# Altium schematic sheet PDM-S04-V00-Microcontroller.SchDoc: Microcontroller
size A3; DrawnBy: Zoe Goodward; Organization: QUT Motorsport; Address1: O-120, Gardens Point; Address2: 2 George Street; Address3: Brisbane, QLD 4000; Address4: Australia; DocumentNumber: 4; Revision: 00; SheetNumber: 4; SheetTotal: 9; Version: 00; Project: Power Distribution Module; PageSetup: Record=PageOptions|CenterHorizontal=True|CenterVertical=True|PrintScale=0.97|XCorrection=1.00|YCorrection=1.00|PrintKind=0|BorderSize=5000000|LeftOffset=0|BottomOffset=0|Orientation=2|PaperLength=1000|PaperWidth=1000|Scale=100|PaperSource=7|PrintQuality=-4|MediaType=1|DitherType=10|PaperKind=A4|PrintScaleMode=1
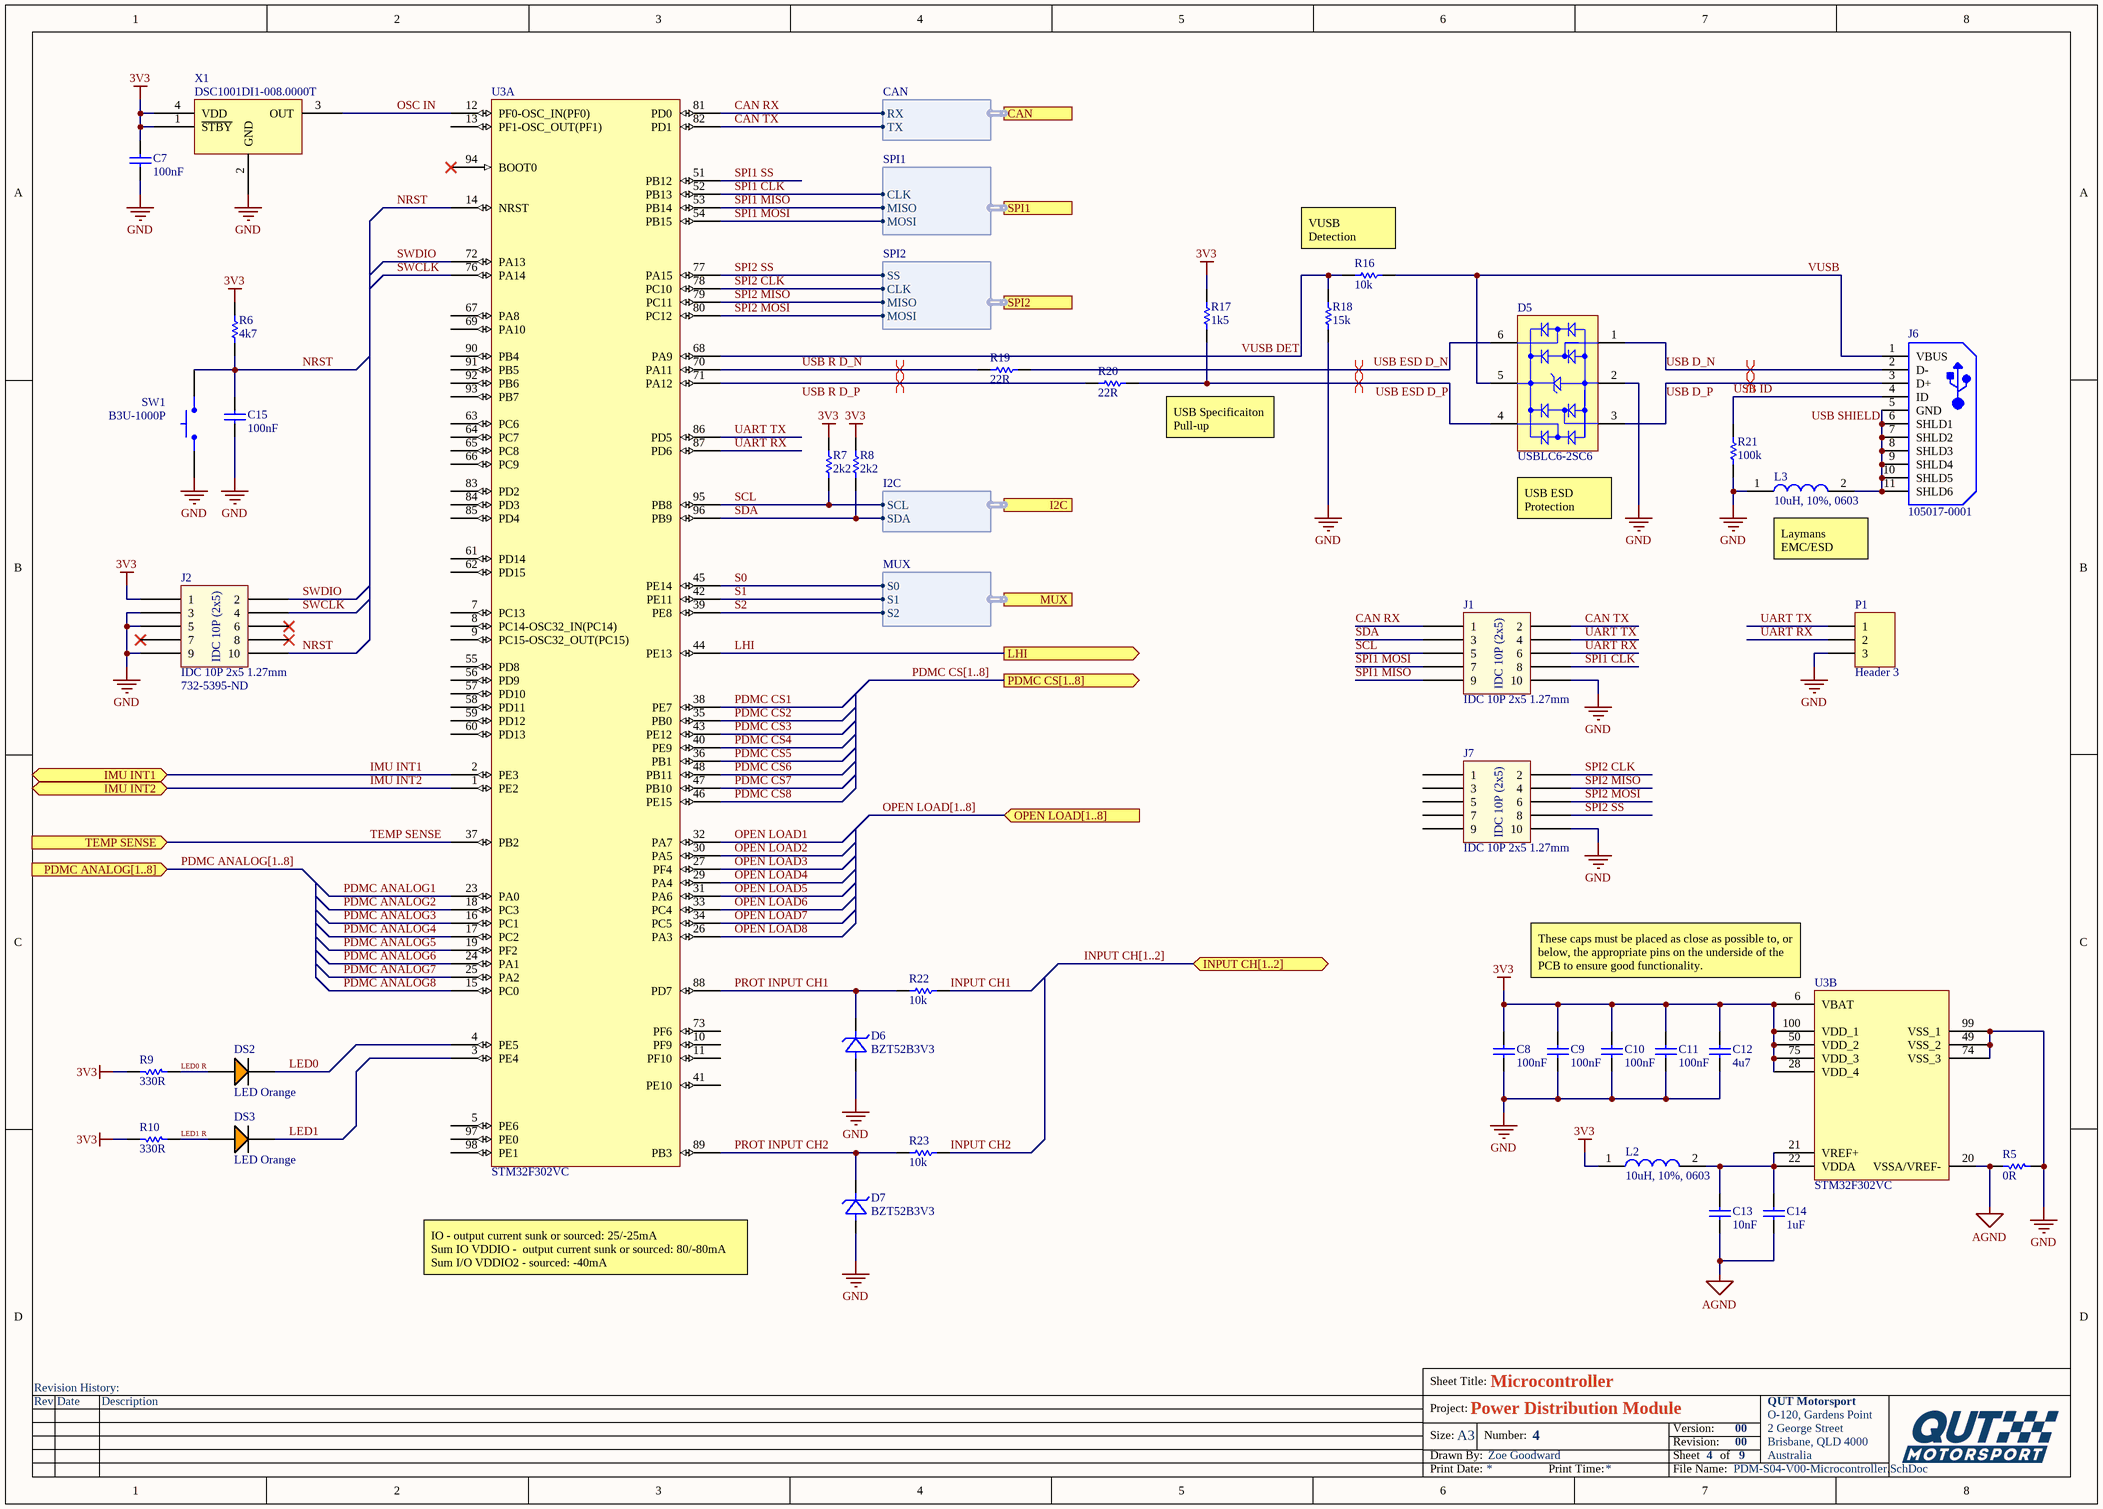
[diagram p0: PDM-S04-V00-Microcontroller.SchDoc]

## Parts
C7  100nF  [Cap_Ceramic_0603]
C8  100nF  [Cap_Ceramic_0603]
C9  100nF  [Cap_Ceramic_0603]
C10  100nF  [Cap_Ceramic_0603]
C11  100nF  [Cap_Ceramic_0603]
C12  4u7  [Cap_Ceramic_0603]
C13  10nF  [Cap_Ceramic_0603]
C14  1uF  [Cap_Ceramic_0603]
C15  100nF  [Cap_Ceramic_0603]
D5  USBLC6-2SC6  [STM-SOT23-6L_V]
D6  BZT52B3V3  [SOD123]
D7  BZT52B3V3  [SOD123]
DS2  LED Orange  [LED ORANGE 0603]
DS3  LED Orange  [LED ORANGE 0603]
J1  IDC 10P 2x5 1.27mm  [IDC 1.27MM 10P]
J2  IDC 10P 2x5 1.27mm  [IDC 1.27MM 10P]
J6  105017-0001  [USB-MICRO-B_V]
J7  IDC 10P 2x5 1.27mm  [IDC 1.27MM 10P]
L2  10uH, 10%, 0603  [Inductor_0603]
L3  10uH, 10%, 0603  [Inductor_0603]
P1  Header 3  [HDR1X3]
R5  0R  [Res_ThinFilm_0603]
R6  4k7  [Res_ThinFilm_0603]
R7  2k2  [Res_ThinFilm_0603]
R8  2k2  [Res_ThinFilm_0603]
R9  330R  [Res_ThinFilm_0603]
R10  330R  [Res_ThinFilm_0603]
R16  10k  [Res_ThinFilm_0603]
R17  1k5  [Res_ThinFilm_0603]
R18  15k  [Res_ThinFilm_0603]
R19  22R  [Res_ThinFilm_0603]
R20  22R  [Res_ThinFilm_0603]
R21  100k  [Res_ThinFilm_0603]
R22  10k  [Res_ThinFilm_0603]
R23  10k  [Res_ThinFilm_0603]
SW1  B3U-1000P  [BTN B3U-1000P]
U3  STM32F302VC  [STM-LQFP100]  (parts A,B of 2)
X1  DSC1001DI1-008.0000T  [DSC1001DI1-008.0000TCT-ND]

## Ports
CAN (harness CAN), I2C (harness I2C), IMU INT1 (bidir), IMU INT2 (bidir), INPUT CH[1..2] (bidir), LHI (out), MUX (harness MUX), OPEN LOAD[1..8] (in), PDMC ANALOG[1..8] (in), PDMC CS[1..8] (out), SPI1 (harness SPI1), SPI2 (harness SPI2), TEMP SENSE (in)

## Harnesses
CAN: RX, TX
SPI1: CLK, MISO, MOSI
MUX: S0, S1, S2
I2C: SDA, SCL
SPI2: CLK, MISO, MOSI, SS

## Nets
3V3: C7.2 C8.2 C9.2 C10.2 C11.2 C12.2 J2.1 L2.1 R6.2 R7.2 R8.2 R9.2 R10.2 R17.2 U3.6(VBAT) U3.28(VDD_4) U3.50(VDD_2) U3.75(VDD_3) U3.100(VDD_1) X1.1(~{STBY}) X1.4(VDD)
AGND: C13.1 C14.1 R5.2 U3.20(VSSA/VREF-)
GND: C7.1 C8.1 C9.1 C10.1 C11.1 C12.1 C15.1 D5.2(GND) D6.A(Anode) D7.A(Anode) J1.10 J2.3 J2.5 J2.9 J7.10 L3.1 P1.3 R5.1 R18.1 R21.1 SW1.1 U3.49(VSS_2) U3.74(VSS_3) U3.99(VSS_1) X1.2(GND)
CAN RX: J1.1 U3.81(PD0) ; port CAN.RX
CAN TX: J1.2 U3.82(PD1) ; port CAN.TX
IMU INT1: U3.2(PE3) ; port IMU INT1
IMU INT2: U3.1(PE2) ; port IMU INT2
INPUT CH1: R22.2
INPUT CH2: R23.2
LED0: DS2.2(C) U3.4(PE5)
LED0 R: DS2.1(A) R9.1
LED1: DS3.2(C) U3.3(PE4)
LED1 R: DS3.1(A) R10.1
LHI: U3.44(PE13) ; port LHI
NRST: C15.2 J2.10 R6.1 SW1.2 U3.14(NRST)
OPEN LOAD1: U3.32(PA7)
OPEN LOAD2: U3.30(PA5)
OPEN LOAD3: U3.27(PF4)
OPEN LOAD4: U3.29(PA4)
OPEN LOAD5: U3.31(PA6)
OPEN LOAD6: U3.33(PC4)
OPEN LOAD7: U3.34(PC5)
OPEN LOAD8: U3.26(PA3)
OSC IN: U3.12(PF0-OSC_IN(PF0)) X1.3(OUT)
PDMC ANALOG1: U3.23(PA0)
PDMC ANALOG2: U3.18(PC3)
PDMC ANALOG3: U3.16(PC1)
PDMC ANALOG4: U3.17(PC2)
PDMC ANALOG5: U3.19(PF2)
PDMC ANALOG6: U3.24(PA1)
PDMC ANALOG7: U3.25(PA2)
PDMC ANALOG8: U3.15(PC0)
PDMC CS1: U3.38(PE7)
PDMC CS2: U3.35(PB0)
PDMC CS3: U3.43(PE12)
PDMC CS4: U3.40(PE9)
PDMC CS5: U3.36(PB1)
PDMC CS6: U3.48(PB11)
PDMC CS7: U3.47(PB10)
PDMC CS8: U3.46(PE15)
PROT INPUT CH1: D6.K(Cathode) R22.1 U3.88(PD7)
PROT INPUT CH2: D7.K(Cathode) R23.1 U3.89(PB3)
S0: U3.45(PE14) ; port MUX.S0
S1: U3.42(PE11) ; port MUX.S1
S2: U3.39(PE8) ; port MUX.S2
SCL: J1.5 R7.1 U3.95(PB8) ; port I2C.SCL
SDA: J1.3 R8.1 U3.96(PB9) ; port I2C.SDA
SPI1 CLK: J1.8 U3.52(PB13) ; port SPI1.CLK
SPI1 MISO: J1.9 U3.53(PB14) ; port SPI1.MISO
SPI1 MOSI: J1.7 U3.54(PB15) ; port SPI1.MOSI
SPI1 SS: U3.51(PB12)
SPI2 CLK: J7.2 U3.78(PC10) ; port SPI2.CLK
SPI2 MISO: J7.4 U3.79(PC11) ; port SPI2.MISO
SPI2 MOSI: J7.6 U3.80(PC12) ; port SPI2.MOSI
SPI2 SS: J7.8 U3.77(PA15) ; port SPI2.SS
SWCLK: J2.4 U3.76(PA14)
SWDIO: J2.2 U3.72(PA13)
TEMP SENSE: U3.37(PB2) ; port TEMP SENSE
UART RX: J1.6 P1.2 U3.87(PD6)
UART TX: J1.4 P1.1 U3.86(PD5)
USB D_N: D5.1(I/O_1) J6.2(D-)
USB D_P: D5.3(I/O_2) J6.3(D+)
USB ESD D_N: D5.6(I/O_4) R19.2
USB ESD D_P: D5.4(I/O_3) R17.1 R20.2
USB ID: J6.4(ID) R21.2
USB R D_N: R19.1 U3.70(PA11)
USB R D_P: R20.1 U3.71(PA12)
USB SHIELD: J6.5(GND) J6.6(SHLD1) J6.7(SHLD2) J6.8(SHLD3) J6.9(SHLD4) J6.10(SHLD5) J6.11(SHLD6) L3.2
VUSB: D5.5(VBUS) J6.1(VBUS) R16.2
VUSB DET: R16.1 R18.2 U3.68(PA9)
NetC13_2: C13.2 C14.2 L2.2 U3.21(VREF+) U3.22(VDDA)

Not connected (* = marked no-connect by the designer): J2 6* 7* 8*; J7 1 3 5 7 9; U3 5(PE6) 7(PC13) 8(PC14-OSC32_IN(PC14)) 9(PC15-OSC32_OUT(PC15)) 10(PF9) 11(PF10) 13(PF1-OSC_OUT(PF1)) 41(PE10) 55(PD8) 56(PD9) 57(PD10) 58(PD11) 59(PD12) 60(PD13) 61(PD14) 62(PD15) 63(PC6) 64(PC7) 65(PC8) 66(PC9) 67(PA8) 69(PA10) 73(PF6) 83(PD2) 84(PD3) 85(PD4) 90(PB4) 91(PB5) 92(PB6) 93(PB7) 94(BOOT0)* 97(PE0) 98(PE1)

## Buses and harness runs
bus INPUT CH[1..2] = port INPUT CH[1..2]
bus OPEN LOAD[1..8] = port OPEN LOAD[1..8]
bus PDMC ANALOG[1..8] = port PDMC ANALOG[1..8]
bus PDMC CS[1..8] = port PDMC CS[1..8]

## Layout directives
differential pair; USB D: true: USB D_N, USB D_P
differential pair: USB ESD D_N, USB ESD D_P, USB R D_N, USB R D_P

## Notes on the sheet
- (near R16) VUSB Detection
- USB Specificaiton Pull-up
- USB ESD Protection
- (near L3) Laymans EMC/ESD
- (near J2) 732-5395-ND
- (near U3) These caps must be placed as close as possible to, or below, the appropriate pins on the underside of the PCB to ensure good functionality.
- IO - output current sunk or sourced: 25/-25mA
  Sum IO VDDIO -  output current sunk or sourced: 80/-80mA
  Sum I/O VDDIO2 - sourced: -40mA
- Revision History:
- Sheet Title:
- Rev
- Date
- Description
- Project:
- Size:
- Drawn By:
- A3
- Number:
- Revision:
- Sheet
- Version:
- of
- QUT Motorsport
- O-120, Gardens Point
- 2 George Street
- Brisbane, QLD 4000
- Australia
- Print Date:
- Print Time:
- File Name:
- (in symbol IDC 10P 2x5 1.27mm) IDC 10P (2x5)

## Library data of the parts
C7-C11 C15 = 100nF 50V 5% X7R 0603: Capacitor, Ceramic, SMD, 100nF, 50V, 5%, X7R, 0603
C12 = 4u7 50V 5% X7R 0603: Capacitor, Ceramic, SMD, 4u7, 50V, 5%, X7R, 0603
C13 = 10nF 50V 5% X7R 0603: Capacitor, Ceramic, SMD, 10nF, 50V, 5%, X7R, 0603
C14 = 1uF 25V 5% X7R 0603: Capacitor, Ceramic, SMD, 1uF, 25V, 5%, X7R, 0603
D5 = CMP-2000-05378-1: Very low capacitance ESD protection, 3.5 pF, -40 to 125 degC, 6-Pin SOT23, RoHS, Tape and Reel; Manufacturer: STMicroelectronics; Polarity: Uni-Directional; Clamping Voltage: 17V; Rad Hardened: No; Product Height (mm): 1.3mm; Leakage Current (Max): 0.15uA; Product Length (mm): 3.05mm; Number of Elements: 1; Peak Pulse Current: 5A; Configuration: Dual; Reverse Breakdown Voltage: 6V; Working Voltage (Max): 5V; Capacitance Value: 3.5pF; Suppressor Type: DiodeArrays; Product Depth (mm): 1.75mm; Test Current (It): 1mA; Package / Case: SOT-23; Operating Temperature Max Deg. C: 125C; Package Description: 6-Pin Small Outline Transistor, Body 2.925 x 1.625 mm, Pitch 0.95 mm; Package Reference: SOT23-6L; Datasheet Version: Rev. 5, 10/2011; Operating Temperature Min Deg. C: -40C; Mounting Style: SurfaceMount; Direction Type: Uni-Directional; Mounting: SurfaceMount; Pin Count: 6; Leakage Current: 0.15uA; Packaging: TapeandReel; Operating Temperature Classification: Automotive; Clamping Voltage (Max): 17V; Manufacturer URL: http://www.st.com/; Reverse Stand-off Voltage: 5V; Datasheet URL: http://www.st.com/st-web-ui/static/active/en/resource/technical/document/datasheet/CD00050750.pdf; Working Voltage: 5V; Operating Temp Range: -40Cto125C
D6 D7 = BZT52B3V3: Diode, SMD, Zener, 3.3V, 2%, 410mW, SOD-123; ComponentLink1Description: Datasheet; ComponentLink1URL: https://www.vishay.com/docs/85760/bzt52.pdf; ComponentLink2Description: Digikey; ComponentLink2URL: https://www.digikey.com/product-detail/en/vishay-semiconductor-diodes-division/BZT52B3V3-E3-08/112-BZT52B3V3-E3-08CT-ND/8564806
DS2 DS3 = LED ORANGE 0603
J6 = CMP-2000-05827-1: Micro-USB B Receptacle, Right Angle, Bottom Mount, Surface Mount, with Solder Tabs, -30 to 85 degC, 5-Pin USB, RoHS, Tape and Reel; Manufacturer: Molex; Featured Product: Micro-USBConnectorsUSBConnectors; Other Names: WM1399DKR; Package Version: Rev. F, 12/2012; Number of Contacts: 5; Connector Type: USB-microB; Catalog Drawings: 1050170001; 3D Model: 105017-0001.stp; Mating Products: WM17145-ND-CABLEMICROUSBBTOSTDA1.0MWM17147-ND-CABLEMICROUSBBTOSTDA2.0MWM17146-ND-CABLEMICROUSBBTOSTDA1.5M; PCN Assembly/Origin: ResinSupplier21/Oct/2015; Voltage - Max: 30V; Online Catalog: Molex-MicroUSB; Manufacturer URL: http://www.molex.com/; Package Description: 5-Leads USB, Micro B, Body 7.5 x 5 mm, Pitch 0.65 mm; Datasheet URL: http://www.molex.com/elqNow/elqRedir.htm?ref=http://www.molex.com/webdocs/datasheets/pdf/en-us/1050170001_IO_CONNECTORS.pdf; Ingress Protection: -; Datasheet Version: 03/2016; Mounting Type: BoardCutout,SurfaceMount,RightAngle; Circuits: 5; Standard Package: 1; Package Reference: MICRO-B; Package URL: http://www.molex.com/pdm_docs/sd/1050170001_sd.pdf; Category: Connectors,Interconnects; Series: -; RoHS Information: 1050170001CertofCompliance; Features: Shielded,SolderRetention; Family: USB,DVI,HDMIConnectors; Specifications: -; Gender: Receptacle; Packaging: Digi-Reel®; Mounting Technology: SurfaceMount
P1 = Header 3: Header, 3-Pin; LatestRevisionDate: 17-Jul-2002; LatestRevisionNote: Re-released for DXP Platform.; Publisher: Altium Limited
R5 = 0R 5% 0603: Resistor, SMD, 0R, 0.1W, 5%, 0603
R6 = 4k7 5% 0603: Resistor, SMD, 4k7, 0.1W, 5%, 0603
R7 R8 = 2k2 5% 0603: Resistor, SMD, 2k2, 0.1W, 5%, 0603
R9 R10 = 330R 5% 0603: Resistor, SMD, 330R, 0.1W, 5%, 0603
R16 = 10k 1% 0603: Resistor, SMD, 10k, 0.1W, 1%, 0603
R17 = 1k5 5% 0603: Resistor, SMD, 1k5, 0.1W, 5%, 0603
R18 = 15k 5% 0603: Resistor, SMD, 15k, 0.1W, 5%, 0603
R19 R20 = 22R 5% 0603: Resistor, SMD, 22R, 0.1W, 5%, 0603
R21 = 100k 5%, 0603: Resistor, SMD, 100k, 0.1W, 5%, 0603
R22 R23 = 10k 5% 0603: Resistor, SMD, 10k, 0.1W, 5%, 0603
SW1 = BTN B3U-1000P: Omron B3U-1000P Ultra Miniture Switch; ComponentLink1Description: LCSC; ComponentLink1URL: https://lcsc.com/product-detail/Tactile-Switches_BRIGHT-TSA063G50-250_C294565.html
U3 = STM32F302VC: ARM Cortex-M4 32-bit MCU, 256 KB Flash, 32 KB Internal RAM, 87 I/Os, 100-pin LQFP, -40 to 85 degC; PartNumber: STM32F302VCT6; FLASH Size (Prog) (kB): 256; Supply Voltage(Vcc) min (V): 2; Internal RAM Size (kB): 32; I/Os (High Current): 87; D/A Converter: 1x12-bit (1 Channel); Packing: Tray; Operating Frequency(F) (Processor speed) (MHz): 72; ComponentLink1URL: http://www.st.com/web/en/home.html; PackageDescription: 100-Pin Low Profile Quad Flat Package, 14 x 14 mm Body, 0.5 mm Pitch; ComponentLink1Description: Manufacturer URL; ComponentLink2URL: http://www.st.com/st-web-ui/static/active/en/resource/technical/document/datasheet/DM00058181.pdf; Mounting Technology: Surface Mount; Core: ARM Cortex-M4; ComponentLink2Description: Datasheet; ComponentLink3Description: Package Specification; PackageVersion: Rev. 1, 06/2013; ComponentLink3URL: http://www.st.com/st-web-ui/static/active/en/resource/technical/document/data_brief/DM00071938.pdf; PackageReference: LQFP100; DatasheetVersion: Rev. 6
X1 = DSC1001DI1-008.0000T: 8MHz XO (Standard) CMOS Oscillator 1.8 ~ 3.3V Standby (Power Down) 4-SMD, No Lead
L2 L3 = 10uH, 10%, 0603: ComponentLink1Description: Digikey; ComponentLink1URL: https://www.digikey.com.au/product-detail/en/w%C3%BCrth-elektronik/74404064221/732-7261-1-ND/5353241; ComponentLink2Description: LCSC A; ComponentLink2URL: https://lcsc.com/product-detail/Power-Inductors_Sunlord-SWPA6045S221MT_C91047.html; ComponentLink3Description: LCSC B; ComponentLink3URL: https://lcsc.com/product-detail/Power-Inductors_SXN-Shun-Xiang-Nuo-Elec-SMNR6045-221MT_C467145.html